# EAGLE design aurigaBot (EAGLE 5.12)
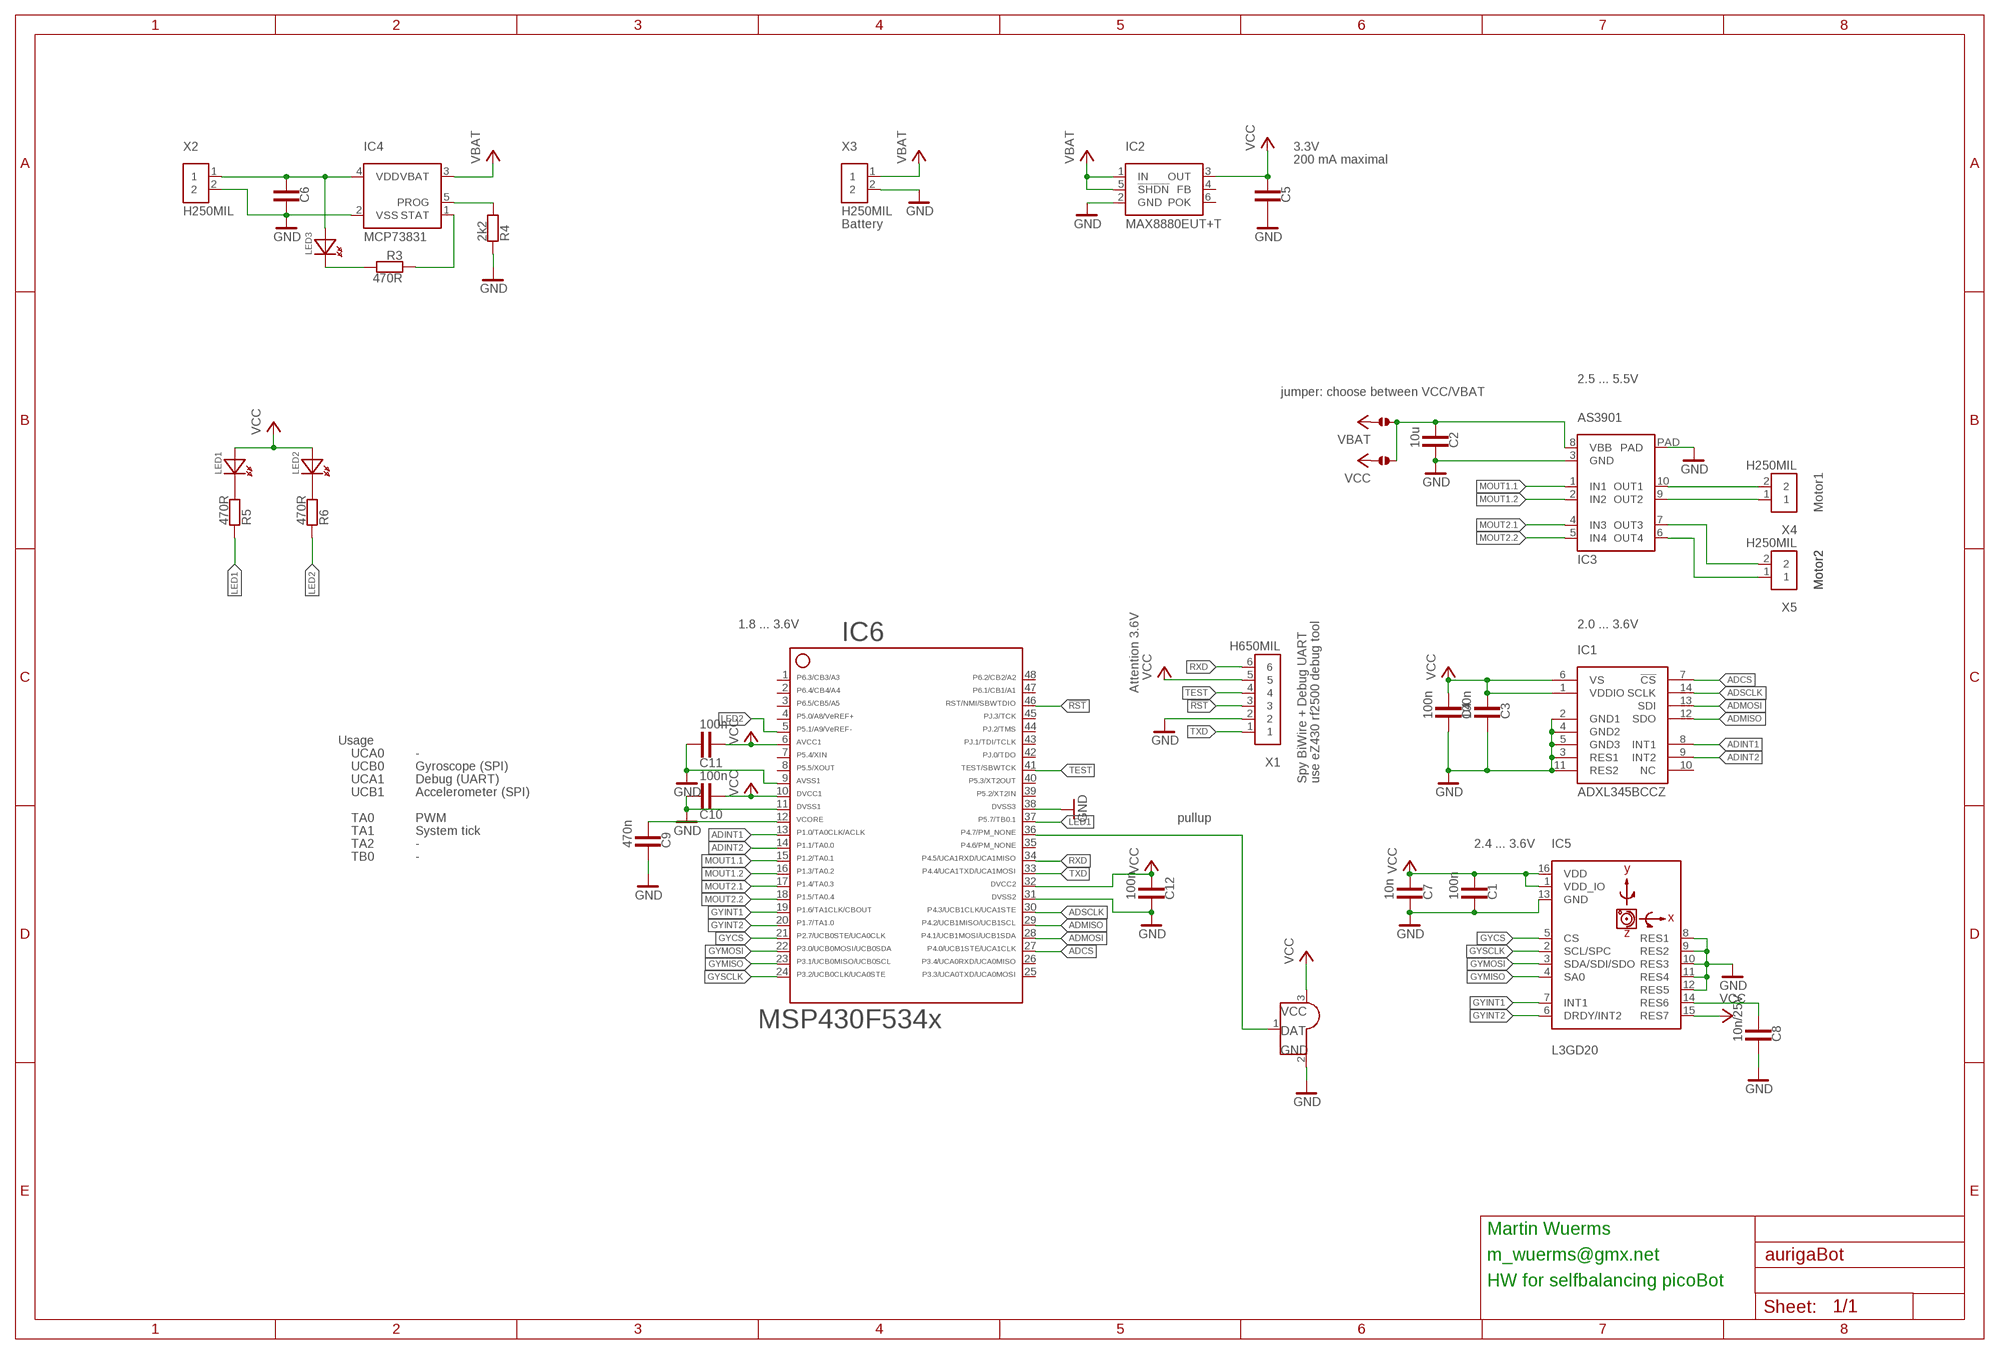
[diagram p0: schematic, sheet 1]

## Parts
C1  100n  C0603  [0603MIL]
C2  10u  C0603  [0603MIL]
C3  100n  C0603  [0603MIL]
C4  100n  C0603  [0603MIL]
C5  C0603  [0603MIL]
C6  C0603  [0603MIL]
C7  10n  C0603  [0603MIL]
C8  10n/25V  C0603  [0603MIL]
C9  470n  C0603  [0603MIL]
C10  100n  C0603  [0603MIL]
C11  100n  C0603  [0603MIL]
C12  100n  C0603  [0603MIL]
IC1  ADXL345BCCZ  [LGA14]
IC2  MAX8880EUT+T  [SOT23-6]
IC3  AS3901  [DFN10]
IC4  MCP73831  [SOT23-5]
IC5  L3GD20  [LGA16]
IC6  MSP430F534X_NOEXP  [QFN48-7X7-NOEXP]
IC7  IRRECEIVER  [IRREC]
LED1  LED0603  [0603MIL_POL]
LED2  LED0603  [0603MIL_POL]
LED3  LED0603  [0603MIL_POL]
R3  470R  R0603  [0603MIL]
R4  2k2  R0603  [0603MIL]
R5  470R  R0603  [0603MIL]
R6  470R  R0603  [0603MIL]
U$5  JMP  [JMP]
U$6  JMP  [JMP]
X1  H650MIL  [HEADER6_50MIL]
X2  H250MIL  [HEADER2_50MIL]
X3  H250MIL  [HEADER2_50MIL]
X4  H250MIL  [HEADER2_50MIL]
X5  H250MIL  [HEADER2_50MIL]

## Nets
!RST: IC6.46 X1.3
ADCS: IC1.7(!CS) IC6.27
ADINT1: IC1.8(INT1) IC6.13
ADINT2: IC1.9(INT2) IC6.14
ADMISO: IC1.12(SDO) IC6.29
ADMOSI: IC1.13(SDI) IC6.28
ADSCLK: IC1.14(SCLK) IC6.30
GND: C1.1 C2.1 C3.1 C4.1 C5.1 C6.1 C7.1 C8.1 C9.1 C10.1 C11.1 C12.1 IC1.2(GND1) IC1.3(RES1) IC1.4(GND2) IC1.5(GND3) IC1.11(RES2) IC2.2(GND) IC3.3(GND) IC3.PAD IC4.2(VSS) IC5.8(RES1) IC5.9(RES2) IC5.10(RES3) IC5.11(RES4) IC5.12(RES5) IC5.13(GND) IC6.9 IC6.11 IC6.31 IC6.38 IC7.2(GND) R4.1 X1.2 X2.2 X3.2
GYCS: IC5.5(CS) IC6.21
GYINT1: IC5.7(INT1) IC6.19
GYINT2: IC5.6(DRDY/INT2) IC6.20
GYMISO: IC5.4(SA0) IC6.23
GYMOSI: IC5.3(SDA/SDI/SDO) IC6.22
GYSCLK: IC5.2(SCL/SPC) IC6.24
IRDAT: IC6.36 IC7.1(DAT)
LED1: IC6.37 R5.1
LED2: IC6.5 R6.1
M11: IC3.10(OUT1) X4.2
M12: IC3.9(OUT2) X4.1
M21: IC3.7(OUT3) X5.2
M22: IC3.6(OUT4) X5.1
MOUT1.1: IC3.1(IN1) IC6.15
MOUT1.2: IC3.2(IN2) IC6.16
MOUT2.1: IC3.4(IN3) IC6.17
MOUT2.2: IC3.5(IN4) IC6.18
N$1: LED3.2(K) R3.2
N$2: IC4.1(STAT) R3.1
N$3: IC4.5(PROG) R4.2
N$4: LED1.2(K) R5.2
N$5: LED2.2(K) R6.2
N$6: C2.2 IC3.8(VBB) U$5.2 U$6.2
N$15: C8.2 IC5.14(RES6)
RXD: IC6.34 X1.6
TEST: IC6.41 X1.4
TXD: IC6.33 X1.1
VBAT: IC2.1(IN) IC2.5(!SHDN) IC4.3(VBAT) U$5.1 X3.1
VCC: C1.2 C3.2 C4.2 C5.2 C7.2 C10.2 C11.2 C12.2 IC1.1(VDDIO) IC1.6(VS) IC2.3(OUT) IC5.1(VDD_IO) IC5.15(RES7) IC5.16(VDD) IC6.6 IC6.10 IC6.32 IC7.3(VCC) LED1.1(A) LED2.1(A) U$6.1 X1.5
VCORE: C9.2 IC6.12
VIN: C6.2 IC4.4(VDD) LED3.1(A) X2.1
Unconnected: IC1.10(NC) IC2.4(FB) IC2.6(POK) IC6.1 IC6.2 IC6.3 IC6.4 IC6.7 IC6.8 IC6.25 IC6.26 IC6.35 IC6.39 IC6.40 IC6.42 IC6.43 IC6.44 IC6.45 IC6.47 IC6.48

## Notes on the sheet
- 3.3V
- 200 mA maximal
- Battery
- 2.5 ... 5.5V
- jumper: choose between VCC/VBAT
- Motor1
- Motor2 | Motor2
- 1.8 ... 3.6V | 2.0 ... 3.6V
- Attention 3.6V
- Usage
- UCA0 | -
- UCB0 | Gyroscope (SPI)
- UCA1 | Debug (UART) | Spy BiWire + Debug UART | use eZ430 rf2500 debug tool
- UCB1 | Accelerometer (SPI)
- TA0 | PWM | pullup
- TA1 | System tick
- TA2 | - | 2.4 ... 3.6V
- TB0 | -
- Martin Wuerms
- m_wuerms@gmx.net
- HW for selfbalancing picoBot

## Library data of the parts
C1-C12 = aurigaBot:C
IC1 = aurigaBot:ADXL345BCCZ
IC2 = aurigaBot:MAX8880EUT+T: LDO
IC3 = aurigaBot:AS3901
IC4 = aurigaBot:MCP73831
IC5 = aurigaBot:L3GD20
IC6 = aurigaBot:MSP430F534X_NOEXP
IC7 = aurigaBot:IRRECEIVER
LED1-LED3 = aurigaBot:LED
R3-R6 = aurigaBot:R: R Widerstand im Chip-Gehäuse
U$5 U$6 = aurigaBot:JMP
X1 = aurigaBot:H6
X2-X5 = aurigaBot:H2

## Board
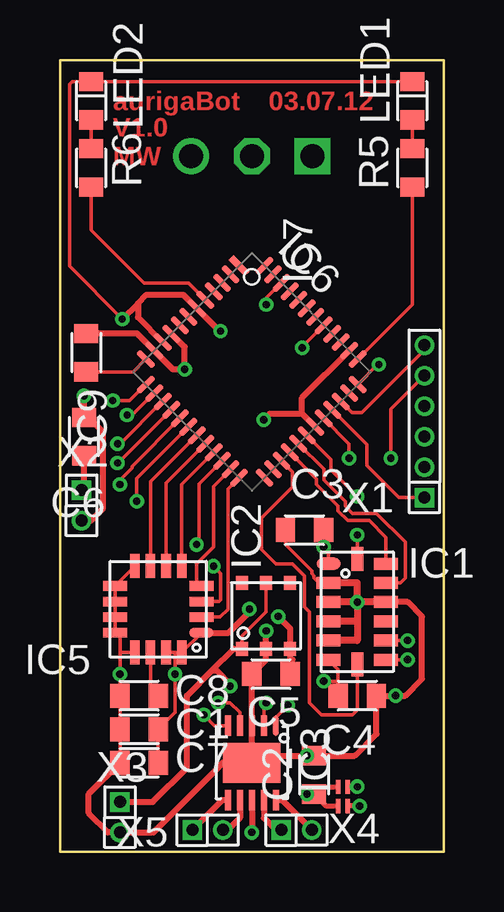
[diagram p1: board, top side]
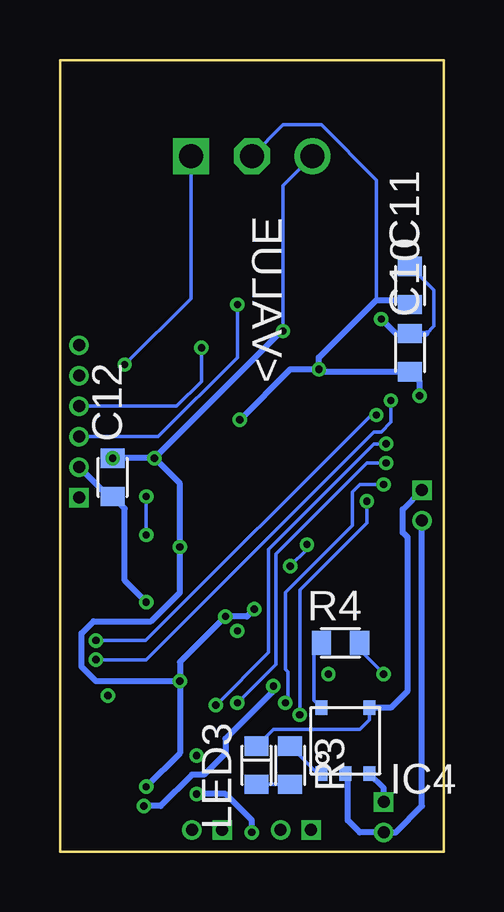
[diagram p2: board, bottom side, seen from below]

Size 16 x 33 mm. Coordinates in mm from the lower left corner, seen from the top.
Outline: 0,33 16,33 16,0 0,0 0,33
Copper layers (1*16): Top 0.035mm / dielectric 1.5mm / Bottom 0.035mm
Design rules "default *": minimum track width 0.15mm, minimum drill 0.2mm, track to track 0.15mm, track to pad 0.15mm, pad to pad 0.15mm, via to via 0.15mm, smd to smd 0mil, copper to edge 0.15mm, drill to drill 0.15mm, minimum pad ring 0.15mm, minimum via ring 0.15mm, stop-mask expansion 4mil, vias tented up to drill 0.5mm, thermal gap 0.2mm
tKeepout: area 0,0 to 2,13; area 14,0 to 16,13
bKeepout: area 14,0 to 16,13; area 0,0 to 2,13

### Footprints (pad centres in the part's own frame; a part is rotated, then mirrored left to right if it is on the bottom)
0603MIL = smd 0.8 x 1: 1 -0.8,0; 2 0.8,0
LGA14 = smd 1 x 0.5: 1 -1.2,2; 2 -1.2,1.2; 3 -1.2,0.4; 4 -1.2,-0.4; 5 -1.2,-1.2; 6 -1.2,-2; 8 1.2,-2; 9 1.2,-1.2; 10 1.2,-0.4; 11 1.2,0.4; 12 1.2,1.2; 13 1.2,2 | smd 0.5 x 1: 7 0,-2.2; 14 0,2.2
SOT23-6 = smd 0.6 x 0.5: 1 -1.35,1; 2 -1.35,0; 3 -1.35,-1; 4 1.4,-1; 5 1.4,0; 6 1.4,1
DFN10 = smd 0.25 x 0.85: 1 -1,-1.55; 2 -0.5,-1.55; 3 0,-1.55; 4 0.5,-1.55; 5 1,-1.55; 6 1,1.55; 7 0.5,1.55; 8 0,1.55; 9 -0.5,1.55; 10 -1,1.55 | smd 2.4 x 1.65: PAD 0,0
SOT23-5 = smd 0.6 x 0.5: 1 -1.35,1; 2 -1.35,0; 3 -1.35,-1; 4 1.4,-1; 5 1.4,1
LGA16 = smd 1 x 0.4: 1 -1.8,0.975; 2 -1.8,0.325; 3 -1.8,-0.325; 4 -1.8,-0.975; 9 1.8,-0.975; 10 1.8,-0.325; 11 1.8,0.325; 12 1.8,0.975 | smd 0.4 x 1: 5 -0.975,-1.8; 6 -0.325,-1.8; 7 0.325,-1.8; 8 0.975,-1.8; 13 0.975,1.8; 14 0.325,1.8; 15 -0.325,1.8; 16 -0.975,1.8
QFN48-7X7-NOEXP = smd 0.95 x 0.28: 1 -3.5,2.75; 2 -3.5,2.25; 3 -3.5,1.75; 4 -3.5,1.25; 5 -3.5,0.75; 6 -3.5,0.25; 7 -3.5,-0.25; 8 -3.5,-0.75; 9 -3.5,-1.25; 10 -3.5,-1.75; 11 -3.5,-2.25; 12 -3.5,-2.75; 25 3.5,-2.75; 26 3.5,-2.25; 27 3.5,-1.75; 28 3.5,-1.25; 29 3.5,-0.75; 30 3.5,-0.25; 31 3.5,0.25; 32 3.5,0.75; 33 3.5,1.25; 34 3.5,1.75; 35 3.5,2.25; 36 3.5,2.75 | smd 0.28 x 0.95: 13 -2.75,-3.5; 14 -2.25,-3.5; 15 -1.75,-3.5; 16 -1.25,-3.5; 17 -0.75,-3.5; 18 -0.25,-3.5; 19 0.25,-3.5; 20 0.75,-3.5; 21 1.25,-3.5; 22 1.75,-3.5; 23 2.25,-3.5; 24 2.75,-3.5; 37 2.75,3.5; 38 2.25,3.5; 39 1.75,3.5; 40 1.25,3.5; 41 0.75,3.5; 42 0.25,3.5; 43 -0.25,3.5; 44 -0.75,3.5; 45 -1.25,3.5; 46 -1.75,3.5; 47 -2.25,3.5; 48 -2.75,3.5
IRREC = drill 1 square: 1 0,2.54 | drill 1 octagon: 2 0,0 | drill 1 round: 3 0,-2.54
0603MIL_POL = smd 0.8 x 1: 1 -0.8,0; 2 0.8,0
JMP = smd 0.2 x 0.6: 1 -0.2,0; 2 0.2,0
HEADER6_50MIL = drill 0.5 pad 0.813 square: 1 0,2.54 | drill 0.5 pad 0.813 round: 2 0,1.27; 3 0,0; 4 0,-1.27; 5 0,-2.54; 6 0,-3.81
HEADER2_50MIL = drill 0.5 pad 0.813 square: 1 0,1.27 | drill 0.5 pad 0.813 round: 2 0,0

### Placement (x,y rotation side)
C1  3.3,5.1 0 top
C2  10.6,3.2 270 top
C3  10.2,13.4 0 top
C4  12.4,6.5 180 top
C5  8.8,7.4 0 top
C6  1,17.3 270 top
C7  3.3,3.7 0 top
C8  3.3,6.5 0 top
C9  1.1,20.8 270 top
C10  1.4,20.8 90 bottom
C11  1.4,23.6 90 bottom
C12  13.8,15.6 90 bottom
IC1  12.4,10 0 top
IC2  8.6,9.8 90 top
IC3  8,3.7 180 top
IC4  4.1,4.6 90 bottom
IC5  4.1,10.1 180 top
IC6  8,20 315 top
IC7  8,29 270 top
LED1  14.7,31.3 270 top
LED2  1.3,31.3 270 top
LED3  7.8,3.6 270 bottom
R3  6.4,3.6 270 bottom
R4  4.3,8.7 180 bottom
R5  14.7,28.5 90 top
R6  1.3,28.5 90 top
U$5  11.8,1.9 180 top
U$6  11.8,2.7 180 top
X1  15.2,17.3 180 top
X2  0.9,13.8 0 top
X3  2.5,0.8 0 top
X4  10.5,0.9 90 top
X5  6.8,0.9 90 top

### Tracks (layer width: path | path; a pad name or v marks a point on that pad's centre or on a via)
!RST  (via drill 0.3)
  Top 0.15: IC6.46 8.6,23.07 v8.6,22.8
  Bottom 0.15: X1.3 11.9,17.3 8.6,20.6 v8.6,22.8
ADCS
  Top 0.15: IC1.7 12.4,5.9 12.2,5.7 10.9,5.7 10.4,6.2 10.4,10 10.2,10.2 10.2,11.5 9.7,12 9,12 8.4,12.6 8.4,13.9 9.7,15.2 9.7,15.82 IC6.27
ADINT1  (via drill 0.3, 0.3 pad 0.5)
  Top 0.15: v2.2,18.8 2.91,18.8 IC6.13 | v14.5,8 IC1.8
  Bottom 0.15: v2.2,18.8 2.2,17.9 2.6,17.5 2.9,17.5 12.4,8 v14.5,8
ADINT2  (via drill 0.3, 0.3 pad 0.5)
  Top 0.15: v14.5,8.8 IC1.9 | IC6.14 3.02,18.2 v2.8,18.2
  Bottom 0.15: v14.5,8.8 12.42,8.8 3.02,18.2 v2.8,18.2
ADMISO
  Top 0.15: IC1.12 14.2,11.2 14.4,11.4 14.4,12.9 13.2,14.1 12.2,14.1 11.9,14.4 11.9,14.6 11,15.5 11,15.94 IC6.29
ADMOSI
  Top 0.15: IC1.13 13.6,13.1 12.9,13.8 12,13.8 11.6,14.2 11.6,14.4 10.7,15.3 10.7,15.53 IC6.28
ADSCLK  (via drill 0.3)
  Top 0.15: IC6.30 11.3,16.35 11.3,15.9 v12.4,14.8 | IC1.14 v12.4,13.2
  Bottom 0.15: v12.4,13.2 v12.4,14.8
GND  (via drill 0.3, 0.3 pad 0.5)
  Top 0.15: C7.1 C1.1 C8.1 v2.5,7.4 2.5,8.3 | 2.5,8.3 2.5,8.93 IC5.12 IC5.11 IC5.10 IC5.9 IC5.8 | 2.5,8.3 IC5.13 | IC3.PAD 8.3,4 | C4.1 v14,6.5 | 11.1,11.2 10.8,11.2 10.6,11.4 10.6,11.5 10.5,11.6 10.5,11.7 9.4,12.8 C3.1
  Top 0.25: 8.3,4 v10.3,4 C2.1 12.3,4 13.2,4.9 C4.1 14.4,6.5 15.1,7.2 15.1,9.8 14.5,10.4 IC1.11 | C9.1 3.22,21.6 IC6.11 4.72,20.1 v5.2,20.1 5.2,21.03 IC6.9 | IC6.38 10.1,18.92 10.1,18.25 | 10.1,18.25 IC6.31 | 10.1,18.25 8.75,18.25 v8.5,18 | C7.1 1.2,2.4 1.2,1.6 2,0.8 X3.2 3.9,0.8 6.8,3.7 IC3.PAD IC3.3 C5.1 8.6,8 IC2.2 v8.6,9.2 | IC1.2 11.1,11.2 | X2.2 1.3,13.8 1.8,14.3 1.8,17.5 1.2,18.1 C6.1 v1,19
  Top 0.3: IC1.5 12.4,8.8 12.4,9.6 | v12.4,10.4 12.4,9.6 | IC1.11 v12.4,10.4 | IC1.2 12.4,11.2 v12.4,10.4 | 12.4,9.6 IC1.4 | v12.4,10.4 IC1.3
  Bottom 0.15: 1.6,23 C11.1 | 5.1,20 v5.2,20.1 | C12.1 13.97,14.8 | R4.1 3.5,8.4 v2.5,7.4 | IC7.2 6.7,30.3 5.1,30.3 2.8,28 2.8,23
  Bottom 0.25: 1.6,23 2.8,23 5.2,20.6 v5.2,20.1 6.4,20.1 v8.5,18 | 5.1,20 C10.1 1,19.6 v1,19 | 13.97,14.8 X1.2 | IC4.2 4,3.15 4,1.3 3.5,0.8 X3.2 2,0.8 0.9,1.9 X2.2 | C12.1 13.3,14.3 13.3,11.3 v12.4,10.4
GYCS
  Top 0.15: IC6.21 5.08,15.31 IC5.5
GYINT1
  Top 0.15: IC6.19 3.77,15.42 IC5.7
GYINT2
  Top 0.15: IC5.6 4.42,15.36 IC6.20
GYMISO
  Top 0.15: IC6.23 6.4,15.22 6.4,12.7 5.9,12.2 5.7,12 5.7,11.07 IC5.4
GYMOSI  (via drill 0.3)
  Top 0.15: IC5.3 6.62,10.43 6.7,10.5 6.7,11.6 v6.4,11.9 | IC6.22 5.8,15.32 5.8,12.9 v5.7,12.8
  Bottom 0.15: v6.4,11.9 5.7,12.6 v5.7,12.8
GYSCLK
  Top 0.15: IC5.2 6.67,9.78 7,10.1 7,15.11 IC6.24
IRDAT  (via drill 0.3 pad 0.5)
  Top 0.15: IC6.36 13.25,20.3 v13.3,20.3
  Bottom 0.15: v13.3,20.3 10.54,23.06 IC7.1
LED1
  Top 0.15: IC6.37 14.7,22.81 R5.1
LED2
  Top 0.15: IC6.5 5.36,23.7 3.5,23.7 1.3,25.9 R6.1
M11
  Top 0.25: IC3.10 9.25,2.15 X4.2
M12
  Top 0.25: X4.1 9,0.9 8.5,1.4 IC3.9
M21
  Top 0.25: X5.2 7,0.9 7.5,1.4 IC3.7
M22
  Top 0.25: IC3.6 6.78,2.15 X5.1
MOUT1.1  (via drill 0.3, 0.3 pad 0.5)
  Top 0.15: IC6.15 4.26,18.76 2.5,17 v2.4,17 | IC3.1 9,5.6 v9.5,6.1
  Bottom 0.15: v2.4,17 2.9,17 7.3,12.6 7.3,8.3 v9.5,6.1
MOUT1.2  (via drill 0.3, 0.3 pad 0.5)
  Top 0.15: IC6.16 2.43,16.2 v2.4,16.2 | v8.6,6.2 8.5,6.1 IC3.2
  Bottom 0.15: v2.4,16.2 3.2,16.2 7,12.4 7,7.8 v8.6,6.2
MOUT2.1  (via drill 0.3, 0.3 pad 0.5)
  Top 0.15: IC3.4 7.5,5.8 7.1,6.2 v6.6,6.2 | IC6.17 3,16.06 3,16 2.5,15.5 v2.5,15.3
  Bottom 0.15: v2.5,15.3 3.5,15.3 3.8,15 3.8,13.6 6.6,10.8 6.6,7.6 6.5,7.5 6.5,6.3 v6.6,6.2
MOUT2.2  (via drill 0.3, 0.3 pad 0.5)
  Top 0.15: v3.2,14.6 3.2,15.55 IC6.18 | IC3.5 6.45,5.25 v6,5.7
  Bottom 0.15: v6,5.7 6,10.9 3.2,13.7 v3.2,14.6
N$1
  Bottom 0.15: R3.2 LED3.2
N$2
  Bottom 0.15: IC4.1 5.25,3.25 R3.1
N$3
  Bottom 0.15: IC4.5 5.4,6.3 5.4,8.4 R4.2
N$4
  Top 0.15: R5.2 LED1.2
N$5
  Top 0.15: R6.2 LED2.2
N$6  (via drill 0.3)
  Top 0.2: U$5.2 11.1,1.9 C2.2 10.9,2.7 U$6.2
  Top 0.25: IC3.8 v8,0.8 | v10.3,2.4 C2.2
  Bottom 0.25: v10.3,2.4 9.1,2.4 8,1.3 v8,0.8
N$15
  Top 0.15: C8.2 3.77,6.83 IC5.14
RXD
  Top 0.15: X1.6 15.2,20.9 12.6,18.3 12.18,18.3 IC6.34
TEST  (via drill 0.3)
  Top 0.15: IC6.41 10.1,21.04 v10.1,21
  Bottom 0.15: X1.4 11.13,18.57 10.1,19.6 v10.1,21
TXD
  Top 0.15: X1.1 14.14,14.76 12.8,16.1 12.8,16.97 IC6.33
VBAT  (via drill 0.3, 0.3 pad 0.5)
  Top 0.15: IC2.1 7.6,9 8.6,10 IC2.5
  Top 0.2: v12.5,1.9 U$5.1
  Top 0.25: X3.1 3.87,2.07 5.3,3.5 5.3,6.5 6.35,7.55 | IC2.1 7.25,8.45 6.35,7.55 | v7.1,6.9 7.1,7 6.55,7.55 6.35,7.55
  Bottom 0.25: X3.1 2.5,2.65 IC4.3 | v12.5,1.9 11.8,1.9 10.5,3.2 10,3.2 9.1,4.1 9.1,4.7 7.1,6.7 v7.1,6.9
VCC  (via drill 0.3, 0.3 pad 0.5)
  Top 0.15: IC5.16 IC5.15 | IC5.16 IC5.1 | C7.2 C1.2 4.8,5.8 v4.8,7.4 4.8,8.3 IC5.16 | v11,12.7 C3.2 | LED1.1 LED2.1 0.5,32.1 0.4,32 0.4,24.4 v2.6,22.2 | C12.2 13.8,18.44 X1.5 | v6.7,21.7 6.65,21.7 | IC6.32 12.06,17 v12.06,16.4 | 11.2,12.5 IC1.1 | IC1.6 11.6,7.6 11.6,7.1 | 11.6,7.1 C4.2 | v11,7.1 11.6,7.1
  Top 0.2: v12.4,2.7 U$6.1
  Top 0.25: 3.25,22.85 v2.6,22.2 | 3.25,22.85 3.6,23.2 5.15,23.2 IC6.6 6.65,21.7 | IC6.10 3.25,22.27 3.25,22.85 | 9.6,7.9 IC2.3 9.6,9.3 v9.1,9.8 | 9.6,7.9 C5.2 | 9.6,7.9 9.7,8 | IC5.1 7.03,9.12 7.9,10 v7.9,10.1 | v11,12.7 11.2,12.5
  Bottom 0.15: 0.7,21.6 0.4,21.9 0.4,23.4 C11.2 | 6.76,21.7 v6.7,21.7 6.7,27.76 IC7.3
  Bottom 0.25: 0.7,21.6 C10.2 2,21.6 v2.6,22.2 | v12.06,16.4 C12.2 | v12.06,16.4 6.76,21.7 | v11,7.1 11,7.9 v9.1,9.8 8.2,9.8 v7.9,10.1 | v12.4,2.7 11,4.1 v11,7.1 | v11,7.1 14.5,7.1 15.1,7.7 15.1,9.1 14.6,9.6 12.2,9.6 11,10.8 v11,12.7 11,15.34 v12.06,16.4
  other vias: 13.8,16.4
VCORE
  Top 0.15: C9.2 3.05,20 IC6.12
VIN
  Top 0.25: C6.2 1,15.17 X2.1
  Bottom 0.15: LED3.1 7.1,5.1 3.5,5.1 3.1,5.5 IC4.4
  Bottom 0.25: IC4.4 2.2,6 1.5,6.7 1.5,13.1 1.7,13.3 1.7,14.27 X2.1

### Text on the board
Top: aurigaBot | 03.07.12 | V1.0 | MW
tDocu: 16 x 30 | 16 = (0.1 - 15.9)